# Altium schematic sheet power2.SchDoc
size A4; SheetNumber: 2; SheetTotal: 2
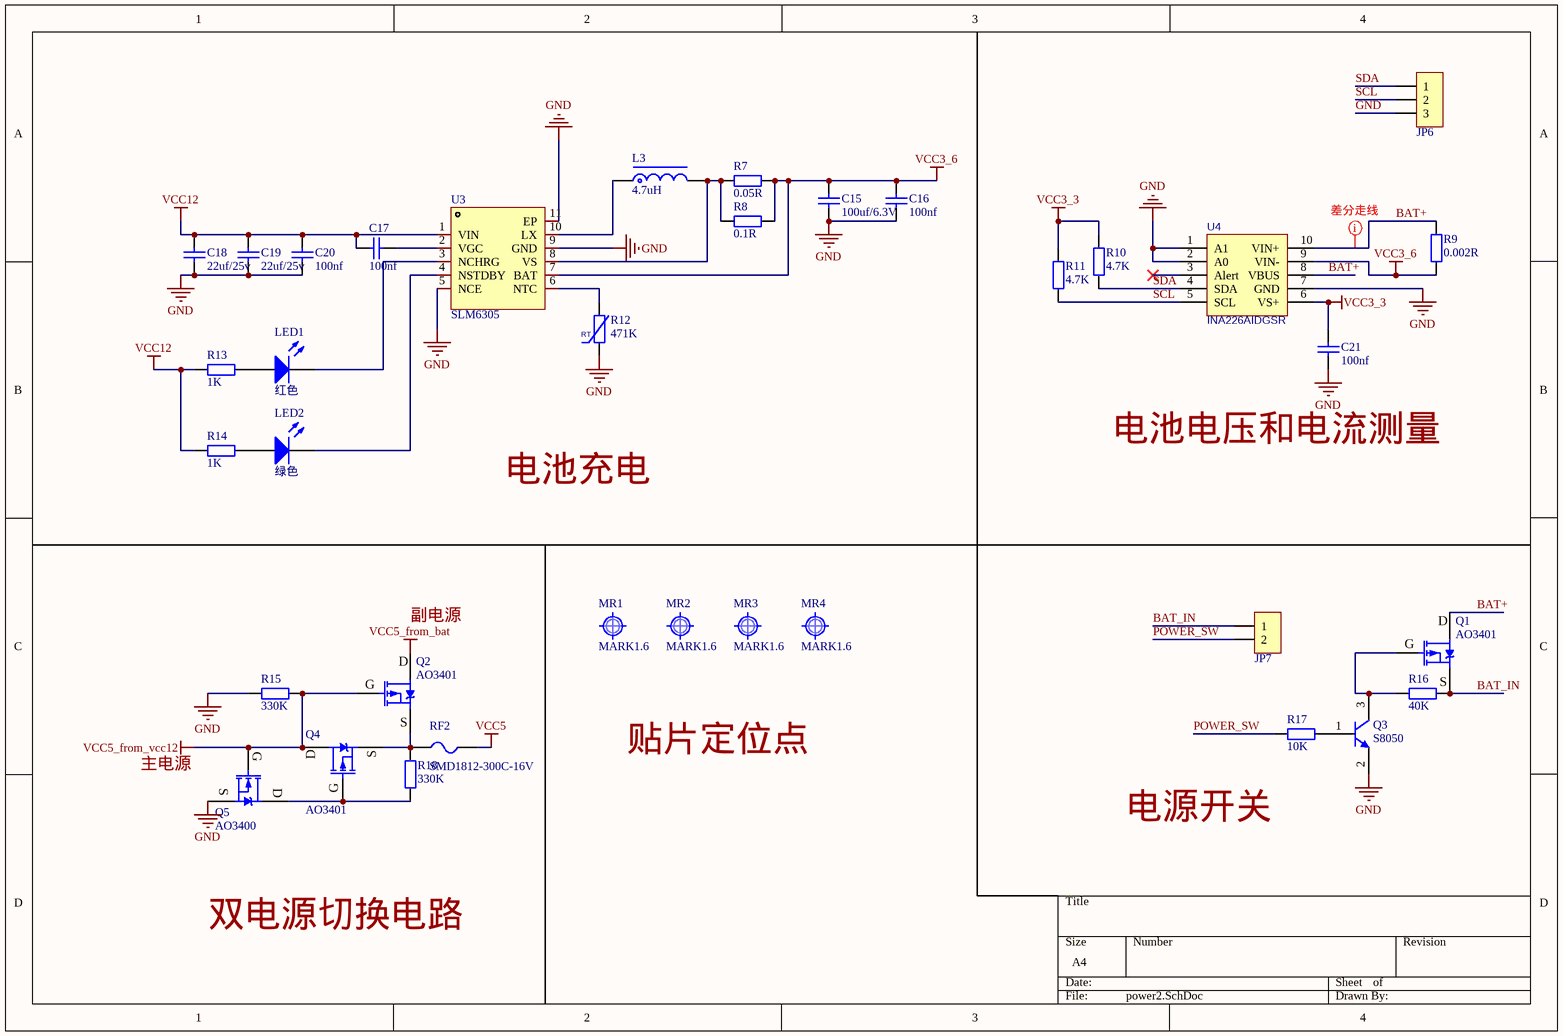
[diagram p0: power2.SchDoc]

## Parts
C15  100uf/6.3V  [C1206_L]
C16  100nf  [C0603_L]
C17  100nf  [C0603_L]
C18  22uf/25v  [C0805_L]
C19  22uf/25v  [C0805_L]
C20  100nf  [C0603_L]
C21  100nf  [C0603_L]
JP6  HDR-1X3  [HDR2.54-LI-3P]  (value not drawn)
JP7  HDR-1X2  [PH2.0-W-2P]  (value not drawn)
L3  4.7uH  [CD53]
LED1  红色  [LED0603_Y]
LED2  绿色  [LED0603_Y]
MR1  MARK1.6  [Mark 1]
MR2  MARK1.6  [Mark 1]
MR3  MARK1.6  [Mark 1]
MR4  MARK1.6  [Mark 1]
Q1  AO3401  [SOT23-3N]
Q2  AO3401  [SOT23-3N]
Q3  S8050  [SOT23-3M]
Q4  AO3401  [SOT23-3N]
Q5  AO3400  [SOT23-3N]
R7  0.05R  [R1206_L]
R8  0.1R  [R1206_L]
R9  0.002R  [R2512_M]
R10  4.7K  [R0603_L]
R11  4.7K  [R0603_L]
R12  471K  [PK0406]
R13  1K  [R0603_L]
R14  1K  [R0603_L]
R15  330K  [R0603_L]
R16  40K  [R0603_L]
R17  10K  [R0603_L]
R18  330K  [R0603_L]
RF2  SMD1812-300C-16V  [F1812]
U3  SLM6305  [DFN10-L3.0-W3.0-P0.5_EP]
U4  INA226AIDGSR  [MSOP10_N]

## Nets
GND: C15.1 C16.1 C18.1 C19.1 C20.2 C21.1 JP6.3 Q3.2(E) Q5.2(S) R12.1 R15.2 U3.5(NCE) U3.9(GND) U3.11(EP) U4.1(A1) U4.2(A0) U4.7(GND)
VCC3_3: C21.2 R10.2 R11.2 U4.6(VS+)
VCC3_6: C15.2 C16.2 R7.2 R8.2 R9.2 U3.7(BAT) U4.9(VIN-)
VCC5: RF2.1
VCC5_from_bat: Q2.3(D)
VCC5_from_vcc12: Q2.1(G) Q4.3(D) Q5.1(G) R15.1
VCC12: C17.2 C18.2 C19.2 C20.1 R13.1 R14.1 U3.1(VIN)
BAT+: Q1.3(D) R9.1 U4.8(VBUS) U4.10(VIN+)
BAT_IN: JP7.1 Q1.2(S) R16.2
POWER_SW: JP7.2 R17.1
SCL: JP6.2 R11.1 U4.5(SCL)
SDA: JP6.1 R10.1 U4.4(SDA)
NetC17_1: C17.1 U3.2(VGC)
NetL3_1: L3.1 U3.10(LX)
NetL3_2: L3.2 R7.1 R8.1 U3.8(VS)
NetLED1_1: LED1.1(A) R13.2
NetLED1_2: LED1.2(K) U3.3(NCHRG)
NetLED2_1: LED2.1(A) R14.2
NetLED2_2: LED2.2(K) U3.4(NSTDBY)
NetQ1_1: Q1.1(G) Q3.3(C) R16.1
NetQ2_2: Q2.2(S) Q4.2(S) R18.2 RF2.2
NetQ3_1: Q3.1(B) R17.2
NetQ4_1: Q4.1(G) Q5.3(D) R18.1
NetR12_2: R12.2 U3.6(NTC)

Not connected (* = marked no-connect by the designer): U4 3(Alert)*

## Layout directives
mark named 差分走线: BAT+

## Notes on the sheet
- 电池电压和电流测量
- 电池充电
- 副电源
- 主电源
- 贴片定位点
- 电源开关
- 双电源切换电路

## Library data of the parts
C15-C21 = C: 贴片电容/MLCC电容; BOM名称: 无极性贴片电容; 联系下单店铺卖家 免费帮你查找封装: 联系下单店铺卖家 免费技术指导
  C15 C18 C19: jlc_id: C45783
JP6 = Header 3: 3P接插件; 联系卖家，免费查找封装: 唯一出售店铺网址https://shop463601444.taobao.com; 封装库来自淘宝卖家ID：黄晶宝石: 其他店铺购入均为盗版封装库，请立即申请退款，本店现金奖励50~200元; BOM名称: 3P接插件
JP7 = Header 2: 2P接插件; 封装库来自淘宝卖家：黄晶宝石: 获取最新版本https://shop463601444.taobao.com; 联系下单店铺卖家 免费帮你查找封装: 联系下单店铺卖家 免费技术支持; BOM名称: 2P接插件
L3 = L-SMD: CD系列贴片线绕功率电感; BOM名称: 功率电感; jlc_id: C177246
LED1 LED2 = LED: 贴片LED; 封装库来自淘宝卖家：黄晶宝石: 其他店铺购入均为盗版封装库，无更新权益，请立即申请退款，本店现金奖励200~1000元; BOM名称: 贴片LED
MR1-MR4 = MARK: 光学定位点; 联系下单店铺卖家 免费技术支持: 联系下单店铺卖家 免费帮你查找封装; BOM名称: 光学定位点
Q1 Q2 Q4 = AO3401: P沟道 30V/4.2A; BOM名称: 场效应管; 联系下单店铺卖家 免费帮你查找封装: 联系下单店铺卖家 免费技术支持; 当前库版本V2024.2.3 @淘宝卖家:黄晶宝石: 最新版本发布https://item.taobao.com/item.htm?id=566775463719; 参数: P沟道 30V/4.2A; jlc_id: C347476
Q3 = BCP68: NPN三极管; 联系下单店铺卖家 免费帮你查找封装: 联系下单店铺卖家 免费技术支持; 当前库版本V2024.2.3 @淘宝卖家:黄晶宝石: 最新版本发布https://item.taobao.com/item.htm?id=566775463719
Q5 = AO3400: N沟道 30V/4.2A; BOM名称: 场效应管; 联系下单店铺卖家 免费帮你查找封装: 联系下单店铺卖家 免费技术支持; 当前库版本V2024.2.3 @淘宝卖家:黄晶宝石: 最新版本发布https://item.taobao.com/item.htm?id=566775463719; 参数: N沟道 30V/4.2A; jlc_id: C20917
R7-R11 R13-R18 = R: 贴片电阻; 联系下单店铺卖家 免费帮你查找封装: 联系下单店铺卖家 免费技术指导; BOM名称: 贴片电阻
  R7: jlc_id: C127691
  R8: jlc_id: C25334
  R9: jlc_id: C2994640
R12 = RT: 热敏电阻; BOM名称: 压敏电阻; 当前库版本V2024.3.30 @淘宝卖家:黄晶宝石: 最新版本发布https://item.taobao.com/item.htm?id=566775463719
RF2 = FUSE-PPTC: PPTC自恢复保险丝; 当前库版本V2024.3.30 @淘宝卖家:黄晶宝石: 最新版本发布https://item.taobao.com/item.htm?id=566775463719; BOM名称: PPTC自恢复保险丝; jlc_id: C2760295
U3 = SLM6305: 1锂电池充电ic 2.5a 4.2v 4V~26V输入; Manufacturer: 无锡松朗微; Add into BOM: yes; The Chip Type: 降压充电芯片; Supply Voltage: 4V~26V; Type of Battery: 锂离子/聚合物; Number of Cells: 1; Symbol: SLM6305; Device: SLM6305; Supplier: LCSC; jlc_id: C711584; Manufacturer Part: SLM6305; JLCPCB Part Class: 扩展库; LCSC Part Name: 宽输入电压2.5A单节锂电池充电管理IC; Supplier Footprint: TDFN-10-EP(3x3); Datasheet: https://atta.szlcsc.com/upload/public/pdf/source/20200723/C711584_2224278DBAF55B7B34A102BEBD70C238.pdf; Convert to PCB: yes; Maximum Charge Current: 2.5A; Charging Saturation Voltage: 4.2V; Operating Temperature: -40℃~+85℃
U4 = INA226: 双向电流/功率监视器芯片; 封装库来自淘宝卖家：黄晶宝石: 其他店铺购入均为盗版封装库，无更新权益，请立即申请退款，联系卖家：黄晶宝石 获取现金奖励200~5000元